# Altium schematic sheet Heater.SchDoc: {Наименование}
size 420 x 297 mm; ApprovedBy: {Утвердил}; CheckedBy: {Проверил}; DrawnBy: {Разработал}; Engineer: {Инженер}; DocumentNumber: {Обозначение}; SheetNumber: {}; SheetTotal: {}; Scale: {Масш.}; Title1str: {Наименование}; PageSetup: Record=PageOptions|CenterHorizontal=False|CenterVertical=False|PrintScale=0.95|XCorrection=0.00|YCorrection=0.00|PrintKind=1|BorderSize=5000000|LeftOffset=0|BottomOffset=0|Orientation=1|PaperLength=1000|PaperWidth=1000|Scale=100|PaperSource=15|PrintQuality=600|MediaType=1|DitherType=10|PaperKind=A4|PrintScaleMode=1; Title2str: {Наименование}; ProcessInspection: {Т.контр.}; Mass: {Масса}; NormInspection: {Н.контр.}; EngineerName: {Инженер}; Letter1Column: {}; Letter2Column: {}; Letter3Column: {}; DocumentType: {Документ}; DocumentType1str: {Документ}; DocumentType2str: {Документ}; ImagePath: {Перв. применение}; Rule: PcbType=ProtelPcb
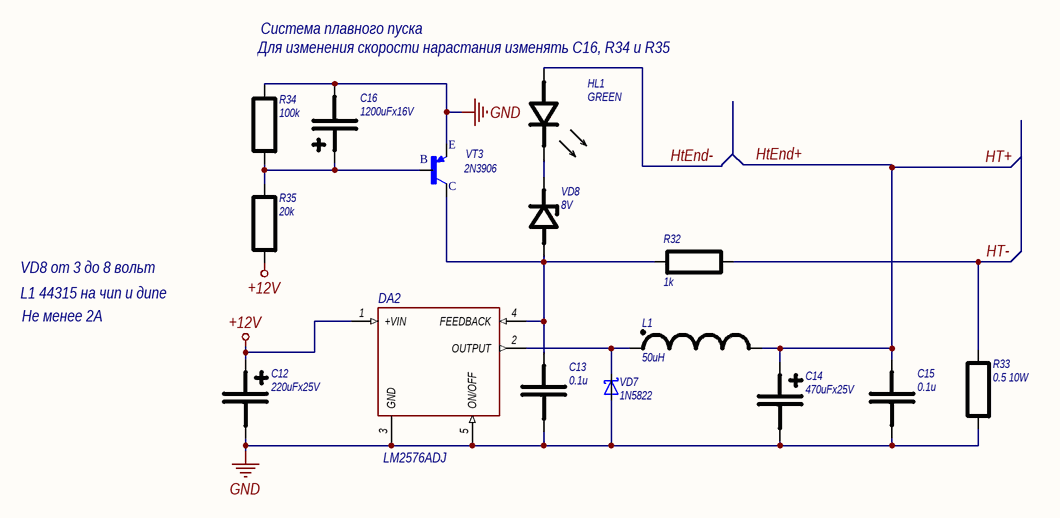
[diagram p0: Heater.SchDoc]

## Parts
C12  220uFx25V  [C8x11.5]
C13  0.1u  [CR2012-0805]
C14  470uFx25V  [C10x16]
C15  0.1u  [CR2012-0805]
C16  1200uFx16V  [C8x20]
DA2  LM2576ADJ  [TO220-5]
HL1  GREEN  [CR3216-1206-LED]
L1  50uH  [RCH114]
R32  1k  [CR2012-0805]
R33  0.5 10W  [R-1W]
R34  100k  [CR2012-0805]
R35  20k  [CR2012-0805]
VD7  1N5822  [DIOAD2120W130L950D530P]
VD8  8V  [SOD-80]
VT3  2N3906  [TO-92]

## Nets
+12V: C12.1 DA2.1(+VIN) R35.1
GND: C12.2 C13.2 C14.2 C15.2 C16.2 DA2.3(GND) DA2.5(ON/OFF) R33.1 R34.2 VD7.A VT3.1(E)
HT+: C14.1 C15.1 L1.2  [also labelled HtEnd+]
HT-: R32.2 R33.2
HtEnd-: HL1.1(A)
NetC13_1: C13.1 DA2.4(FEEDBACK) R32.1 VD8.1(A) VT3.3(C)
NetC16_1: C16.1 R34.1 R35.2 VT3.2(B)
NetDA2_2: DA2.2(OUTPUT) L1.1 VD7.C
NetHL1_2: HL1.2(K) VD8.2(K)

## Notes on the sheet
- Для изменения скорости нарастания изменять С16, R34 и R35
- Система плавного пуска
- VD8 от 3 до 8 вольт
- L1 44315 на чип и дипе
- Не менее 2А
- Перв. примен.
- Справ. №
- Подп. и дата
- Инв. № дубл.
- Взам. инв. №
- Изм.
- Лист
- № докум.
- Подп.
- Дата
- Лит.
- Масса
- Масштаб
- Т.контр.
- Пров.
- Разраб.
- Листов
- Инв. № подл.
- Н.контр.
- Утв.
- Копировал
- Формат А3

## Library data of the parts
C12 = C220uFx25V YAGEO SY: SY025M0220A3F-0811
C13 C15 = C0805-0.1u-X7R
C14 = C470uFx25V KF
C16 = C1000uFx16V LZ
DA2 = LM2576ADJ: <B>LM 2576 Adj</B><br> SIMPLE SWITCHER 3-A Step-Down Voltage Regulator; MF: ON Semiconductor; Availability: Unavailable; Price: None; Package: None; Value: *; SnapEDA_Link: https://www.snapeda.com/parts/LM2576ADJ/ON%20Semiconductor/view-part/543608/?ref=snap; MP: LM2576ADJ
HL1 = LED_GREEN_1206
L1 = RCH114NP-221KB
R32 = R0805-1k-5%
R33 = R-1W-5R1
R34 = R0805-100k-5%
R35 = R0805-20k-5%
VD7 = 1N5822: Diode Schottky 40V 3A Through Hole; MF: ON Semiconductor; Package: DO-201AD-201 Panjit; MP: 1N5822; Value: *; SnapEDA_Link: https://www.snapeda.com/parts/1N5822/ON%20Semiconductor/view-part/1356736/?ref=snap; Price: None; Availability: Unavailable
VD8 = BZV55-C3V0
VT3 = 2N3906: TRANS PNP 40V 0.2A TO92; MF: Diotec Semiconductor; Value: *; MP: 2N3906; Package: TO-226-3 Diotec Semiconductor; Price: None; SnapEDA_Link: https://www.snapeda.com/parts/2N3906/Diotec/view-part/4705783/?ref=snap; Availability: Unavailable